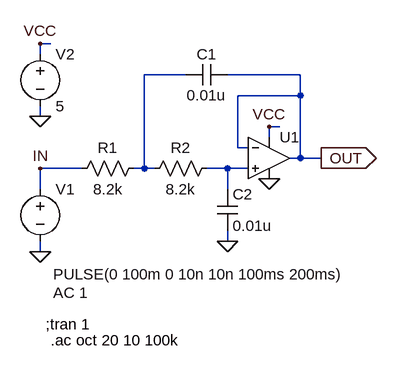
[diagram p0: schematic MIDI_CV_CONV_VCVS_LPF.asc]
MIDI_CV_CONV_VCVS_LPF.asc, the LTspice schematic file:
Version 4
SHEET 1 880 680
WIRE 0 -128 -16 -128
WIRE -16 -112 -16 -128
WIRE 208 -80 144 -80
WIRE 384 -80 272 -80
WIRE 384 -48 384 -80
WIRE 384 -48 288 -48
WIRE -16 -16 -16 -32
WIRE 352 0 336 0
WIRE 336 16 336 0
WIRE 288 32 288 -48
WIRE 304 32 288 32
WIRE 384 48 384 -48
WIRE 384 48 368 48
WIRE 416 48 384 48
WIRE 48 64 -16 64
WIRE 144 64 144 -80
WIRE 144 64 128 64
WIRE 160 64 144 64
WIRE 272 64 240 64
WIRE 304 64 272 64
WIRE -16 96 -16 64
WIRE 272 96 272 64
WIRE 272 176 272 160
WIRE -16 192 -16 176
FLAG 336 0 VCC
FLAG 336 80 0
FLAG 272 176 0
FLAG 416 48 OUT
IOPIN 416 48 Out
FLAG -16 192 0
FLAG -16 -16 0
FLAG -16 -128 VCC
FLAG -16 64 IN
SYMBOL Opamps\\UniversalOpamp2 336 48 R0
SYMATTR InstName U1
SYMBOL res 144 48 R90
WINDOW 0 0 56 VBottom 2
WINDOW 3 32 56 VTop 2
SYMATTR InstName R1
SYMATTR Value 8.2k
SYMBOL res 256 48 R90
WINDOW 0 0 56 VBottom 2
WINDOW 3 32 56 VTop 2
SYMATTR InstName R2
SYMATTR Value 8.2k
SYMBOL cap 272 -96 R90
WINDOW 0 0 32 VBottom 2
WINDOW 3 32 32 VTop 2
SYMATTR InstName C1
SYMATTR Value 0.01u
SYMBOL cap 256 96 R0
SYMATTR InstName C2
SYMATTR Value 0.01u
SYMBOL voltage -16 80 R0
WINDOW 3 20 147 Left 2
WINDOW 123 20 175 Left 2
WINDOW 39 0 0 Left 2
SYMATTR Value PULSE(0 100m 0 10n 10n 100ms 200ms)
SYMATTR Value2 AC 1
SYMATTR InstName V1
SYMBOL voltage -16 -128 R0
WINDOW 123 0 0 Left 2
WINDOW 39 0 0 Left 2
SYMATTR InstName V2
SYMATTR Value 5
TEXT -8 304 Left 2 !;tran 1
TEXT 0 328 Left 2 !.ac oct 20 10 100k

The netlist it stands for:
* MIDI_CV_CONV_VCVS_LPF.asc
XU1 N002 OUT VCC 0 OUT level.2 Avol=1Meg GBW=10Meg Slew=10Meg ilimit=25m rail=0 Vos=0 phimargin=45 en=0 enk=0 in=0 ink=0 Rin=500Meg  ; pins IN+ IN- V+ V- OUT
R1 N001 IN 8.2k
R2 N002 N001 8.2k
C1 OUT N001 0.01u
C2 N002 0 0.01u
V1 IN 0 PULSE(0 100m 0 10n 10n 100ms 200ms) AC 1
V2 VCC 0 5
;tran 1
.ac oct 20 10 100k
.lib UniversalOpamps2.sub
.backanno
.end